# EAGLE design RP (EAGLE 7.6.0)
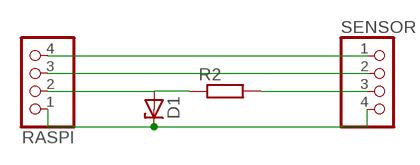
[diagram p0: schematic, sheet 1]

## Parts
D1  ZENER-DIODEDO35Z10  [DO35Z10]
R2  R-EU_0204/7  [0204/7]
RASPI  PINHD-1X4  [1X04]
SENSOR  PINHD-1X4  [1X04]

## Nets
5V: RASPI.4 SENSOR.1
ECHO: D1.A R2.1 RASPI.2
N$1: D1.C RASPI.1 SENSOR.4
N$2: R2.2 SENSOR.3
TRIG: RASPI.3 SENSOR.2

## Library data of the parts
D1 = diode:ZENER-DIODE: Z-Diode
R2 = rcl:R-EU_: RESISTOR, European symbol
RASPI SENSOR = pinhead:PINHD-1X4: PIN HEADER

## Board
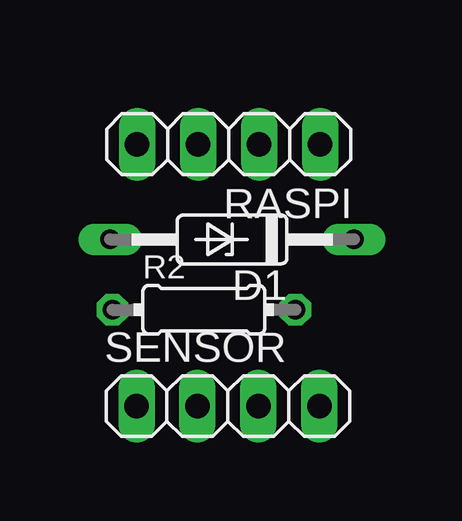
[diagram p1: board, top side]
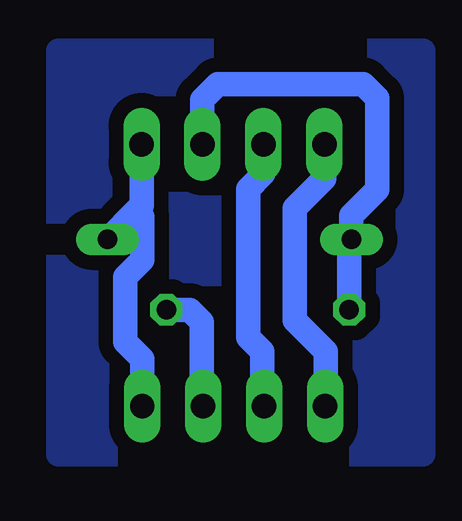
[diagram p2: board, bottom side, seen from below]

No outline drawn. Coordinates in mm, seen from the top.
Copper layers (1*16): Top 0.035mm / dielectric 1.5mm / Bottom 0.035mm
Design rules "default": minimum track width 10mil, minimum drill 24mil, track to track 8mil, track to pad 8mil, pad to pad 8mil, via to via 8mil, smd to smd 8mil, copper to edge 40mil, drill to drill 8mil, minimum pad ring 10mil, minimum via ring 8mil, stop-mask expansion 4mil, vias tented up to drill 0mil, thermal gap 10mil

### Footprints (pad centres in the part's own frame; a part is rotated, then mirrored left to right if it is on the bottom)
DO35Z10 = drill 0.813 long: A 5.08,0; C -5.08,0
0204/7 = drill 0.813 octagon: 1 -3.81,0; 2 3.81,0
1X04 = drill 1.016 long: 1 -3.81,0; 2 -1.27,0; 3 1.27,0; 4 3.81,0

### Placement (x,y rotation side)
D1  19.2,13.81 180 top
R2  18.02,10.88 0 top
RASPI  19.05,17.78 180 top
SENSOR  19.02,6.86 0 top

### Tracks (layer width: path | path; a pad name or v marks a point on that pad's centre or on a via)
5V
  Bottom 1.016: RASPI.4 15.24,16.36 16.47,15.12 16.47,10.43 15.17,9.13 15.17,6.9 SENSOR.1
ECHO
  Bottom 1.016: R2.1 14.21,13.72 D1.A 14.12,14.81 13.04,15.88 13.04,19.69 13.63,20.28 19.68,20.28 20.32,19.64 RASPI.2
GND
  pour Bottom (isolate 0.61): 11.17,21.68 26.32,21.68 26.32,4.86 11.12,4.86 11.12,21.68
N$1
  Bottom 1.016: RASPI.1 22.86,15.22 23.08,15.01 | 23.08,15.01 D1.C | SENSOR.4 22.83,8.82 23.54,9.53 23.54,12.24 22.83,12.95 22.83,14.76 23.08,15.01
N$2
  Bottom 1.016: R2.2 20.85,10.88 20.34,10.38 20.34,6.91 SENSOR.3
TRIG
  Bottom 1.016: RASPI.3 17.78,16.56 18.42,15.91 18.42,9.72 17.83,9.13 17.83,6.94 SENSOR.2